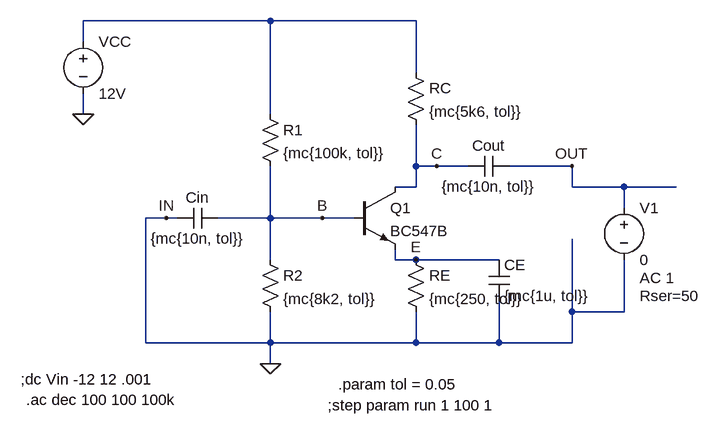
[diagram p0: schematic e1_tp1_ej2.asc]
e1_tp1_ej2.asc, the LTspice schematic file:
Version 4
SHEET 1 984 680
WIRE 176 -32 -112 -32
WIRE 400 -32 176 -32
WIRE -112 0 -112 -32
WIRE 400 48 400 -32
WIRE -112 112 -112 80
WIRE 176 112 176 -32
WIRE 400 192 400 128
WIRE 432 192 400 192
WIRE 480 192 432 192
WIRE 640 192 544 192
WIRE 400 224 400 192
WIRE 400 224 368 224
WIRE 640 224 640 192
WIRE 720 224 640 224
WIRE 800 224 720 224
WIRE 720 256 720 224
WIRE 16 272 -16 272
WIRE 32 272 16 272
WIRE 176 272 176 192
WIRE 176 272 96 272
WIRE 256 272 176 272
WIRE 304 272 256 272
WIRE 176 336 176 272
WIRE 368 336 368 320
WIRE 400 336 368 336
WIRE 528 336 400 336
WIRE 640 416 640 304
WIRE 720 416 720 336
WIRE 720 416 640 416
WIRE -16 464 -16 272
WIRE 176 464 176 416
WIRE 176 464 -16 464
WIRE 400 464 400 416
WIRE 400 464 176 464
WIRE 528 464 528 400
WIRE 528 464 400 464
WIRE 640 464 640 416
WIRE 640 464 528 464
WIRE 176 496 176 464
FLAG -112 112 0
FLAG 176 496 0
FLAG 640 192 OUT
FLAG 256 272 B
FLAG 16 272 IN
FLAG 400 336 E
FLAG 432 192 C
SYMBOL res 160 96 R0
SYMATTR InstName R1
SYMATTR Value {mc{100k, tol}}
SYMBOL voltage -112 -16 R0
SYMATTR InstName VCC
SYMATTR Value 12V
SYMBOL res 384 32 R0
SYMATTR InstName RC
SYMATTR Value {mc{5k6, tol}}
SYMBOL cap 96 256 R90
WINDOW 0 0 32 VBottom 2
WINDOW 3 32 32 VTop 2
SYMATTR InstName Cin
SYMATTR Value {mc{10n, tol}}
SYMBOL res 160 320 R0
SYMATTR InstName R2
SYMATTR Value {mc{8k2, tol}}
SYMBOL res 384 320 R0
SYMATTR InstName RE
SYMATTR Value {mc{250, tol}}
SYMBOL cap 512 336 R0
SYMATTR InstName CE
SYMATTR Value {mc{1u, tol}}
SYMBOL cap 544 176 R90
WINDOW 0 0 32 VBottom 2
WINDOW 3 32 32 VTop 2
SYMATTR InstName Cout
SYMATTR Value {mc{10n, tol}}
SYMBOL npn2 304 224 R0
SYMATTR InstName Q1
SYMATTR Value BC547B
SYMBOL voltage 720 240 R0
WINDOW 123 24 124 Left 2
WINDOW 39 24 152 Left 2
SYMATTR Value2 AC 1
SYMATTR SpiceLine Rser=50
SYMATTR InstName V1
SYMATTR Value 0
TEXT -208 520 Left 2 !;dc Vin -12 12 .001
TEXT -200 552 Left 2 !.ac dec 100 100 100k
TEXT 280 528 Left 2 !.param tol = 0.05
TEXT 264 560 Left 2 !;step param run 1 100 1

The netlist it stands for:
* e1_tp1_ej2.asc
R1 N001 B {mc{100k, tol}}
VCC N001 0 12V
RC N001 C {mc{5k6, tol}}
Cin B 0 {mc{10n, tol}}
R2 B 0 {mc{8k2, tol}}
RE E 0 {mc{250, tol}}
CE E 0 {mc{1u, tol}}
Cout OUT C {mc{10n, tol}}
Q1 C B E 0 BC547B
V1 OUT 0 0 AC 1 Rser=50
.model NPN NPN
.model PNP PNP
.lib standard.bjt
;dc Vin -12 12 .001
.ac dec 100 100 100k
.param tol = 0.05
;step param run 1 100 1
.backanno
.end